# Altium schematic sheet tcc_shield.SchDoc
size A4; PageSetup: Record=PageOptions|CenterHorizontal=True|CenterVertical=True|PrintScale=1.00|XCorrection=1.00|YCorrection=1.00|PrintKind=0|BorderSize=5000000|LeftOffset=0|BottomOffset=0|Orientation=2|PaperLength=1000|PaperWidth=1000|Scale=100|PaperSource=7|PrintQuality=-4|MediaType=1|DitherType=10|PaperKind=A4|PrintScaleMode=1
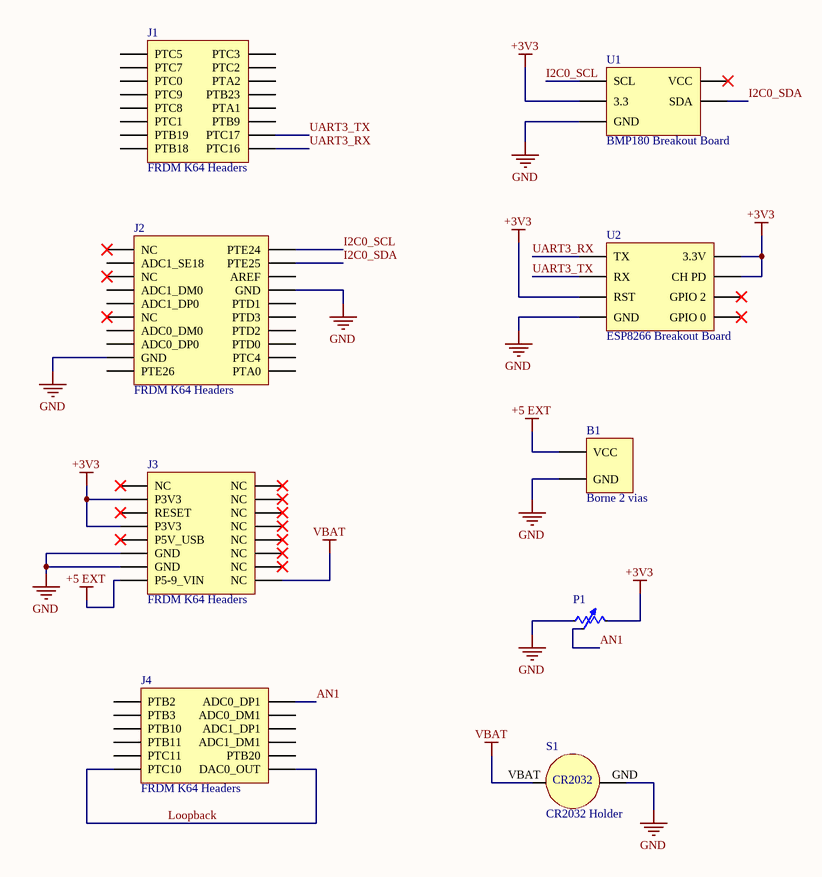
[diagram p0: tcc_shield.SchDoc]

## Parts
B1  Borne 2 vias  [Borne 2 Vias]
FRDM_K64  FRDM K64 Headers  [FRDM K64]  (parts A,B,C,D of 4)
P1  Potenciometro  [Potenciometro]  (value not drawn)
S1  CR2032 Holder  [CR2032 Holder]
U1  BMP180 Breakout Board  [BPM180 Breakout Board]
U2  ESP8266 Breakout Board  [ESP2866 Break Board]

## Nets
+3V3: FRDM_K64.J3_4(P3V3) FRDM_K64.J3_8(P3V3) P1.pot_3 U1.3.3 U2.3.3V U2.CH_PD(CH_PD) U2.RST
+5 EXT: B1.VCC FRDM_K64.J3_16(P5-9_VIN)
GND: B1.GND FRDM_K64.J2_3(GND) FRDM_K64.J2_14(GND) FRDM_K64.J3_12(GND) FRDM_K64.J3_14(GND) P1.pot_1 S1.GND U1.GND U2.GND
VBAT: FRDM_K64.J3_15(NC) S1.VBAT
AN1: FRDM_K64.J4_1(ADC0_DP1) P1.pot_2
I2C0_SCL: FRDM_K64.J2_20(PTE24) U1.SCL
I2C0_SDA: FRDM_K64.J2_18(PTE25) U1.SDA
Loopback: FRDM_K64.J4_11(DAC0_OUT) FRDM_K64.J4_12(PTC10)
UART3_RX: FRDM_K64.J1_2(PTC16) U2.TX
UART3_TX: FRDM_K64.J1_4(PTC17) U2.RX

Not connected (* = marked no-connect by the designer): FRDM_K64 J1_1(PTB18) J1_3(PTB19) J1_5(PTC1) J1_6(PTB9) J1_7(PTC8) J1_8(PTA1) J1_9(PTC9) J1_10(PTB23) J1_11(PTC0) J1_12(PTA2) J1_13(PTC7) J1_14(PTC2) J1_15(PTC5) J1_16(PTC3) J2_1(PTE26) J2_2(PTA0) J2_4(PTC4) J2_5(ADC0_DP0) J2_6(PTD0) J2_7(ADC0_DM0) J2_8(PTD2) J2_9(NC)* J2_10(PTD3) J2_11(ADC1_DP0) J2_12(PTD1) J2_13(ADC1_DM0) J2_15(NC)* J2_16(AREF) J2_17(ADC1_SE18) J2_19(NC)* J3_1(NC)* J3_2(NC)* J3_3(NC)* J3_5(NC)* J3_6(RESET)* J3_7(NC)* J3_9(NC)* J3_10(P5V_USB)* J3_11(NC)* J3_13(NC)* J4_2(PTB2) J4_3(ADC0_DM1) J4_4(PTB3) J4_5(ADC1_DP1) J4_6(PTB10) J4_7(ADC1_DM1) J4_8(PTB11) J4_9(PTB20) J4_10(PTC11); U1 VCC*; U2 GPIO0(GPIO_0)* GPIO2(GPIO_2)*

## Notes on the sheet
- (in symbol CR2032 Holder) CR2032
- (in symbol FRDM K64 Headers, part A) J3
- (in symbol FRDM K64 Headers, part B) J4
- (in symbol FRDM K64 Headers, part C) J1
- (in symbol FRDM K64 Headers, part D) J2